# EAGLE schematic STML451RE_Buck_HSE (EAGLE 9.6.2)

## Sheet 1 of 2
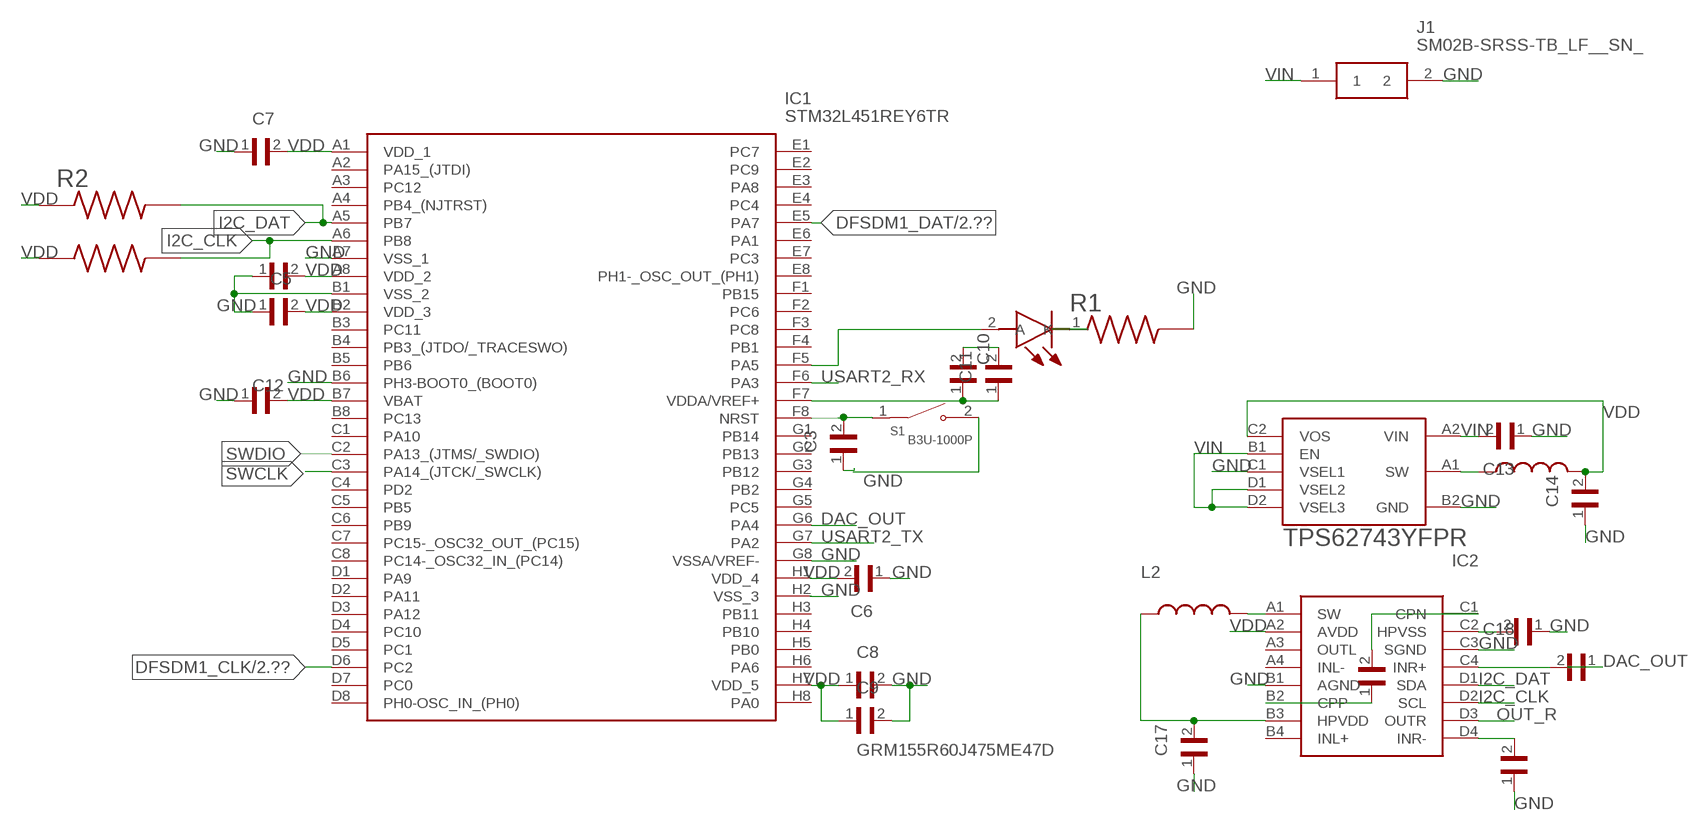
[diagram p0: schematic, sheet 1]

### Parts
C3  GRM033C80J104KE15D  [CAPC0603X33N]
C4  GRM033C80J104KE15D  [CAPC0603X33N]
C5  GRM033C80J104KE15D  [CAPC0603X33N]
C6  GRM033C80J104KE15D  [CAPC0603X33N]
C7  GRM033C80J104KE15D  [CAPC0603X33N]
C8  GRM033C80J104KE15D  [CAPC0603X33N]
C9  GRM155R60J475ME47D  [CAPC1005X60N]
C10  GRM033C80J104KE15D  [CAPC0603X33N]
C11  JMK105C6105KV-F  [CAPC1005X55N]
C12  GRM033C80J104KE15D  [CAPC0603X33N]
C13  GRM155R60J475ME47D  [CAPC1005X60N]
C14  GRM155R60J106ME15D  [CAPC1005X65N]
C17  GRM155R60J225KE95D  [CAPC1005X55N]
C18  GRM155R60J225KE95D  [CAPC1005X55N]
C19  JMK105C6105KV-F  [CAPC1005X55N]
C20  JMK105C6105KV-F  [CAPC1005X55N]
C21  JMK105C6105KV-F  [CAPC1005X55N]
IC1  STM32L451REY6TR  [BGA64C40P8X8_336X366X58]
IC2  TPA6140A2YFFT  [BGA16C40P4X4_156X156X63]
J1  SM02B-SRSS-TB_LF__SN_  [SM02B-SRSS-TB]
L1  1285AS-H-2R2M=P2  [INDC2016X100N]
L2  LQM21PN2R2MC0D  [INDC2012X55N]
LED1  VLMS1500-GS08  [VLMG1500GS08]
R1  CRCW02012K20FKED  [RESC0603X28N]
R2  ERA-2AEB122X  [RESC1005X40N]
R3  ERA-2AEB122X  [RESC1005X40N]
S1  B3U-1000P  [SW_B3U-1000P]
U1  TPS62743YFPR  [BGA8N40P2X4_87X156X50]

### Nets
DAC_OUT: C21.1 IC1.G6(PA4)
DFSDM1_CLK: IC1.D6(PC2) ; also sheet 2
DFSDM1_DAT: IC1.E5(PA7) ; also sheet 2
GND: C3.1 C4.1 C5.1 C6.1 C7.1 C8.2 C9.2 C12.1 C13.1 C14.1 C17.1 C18.1 C20.1 IC1.A7(VSS_1) IC1.B1(VSS_2) IC1.B6(PH3-BOOT0_(BOOT0)) IC1.G8(VSSA/VREF-) IC1.H2(VSS_3) IC2.B1(AGND) IC2.C3(SGND) J1.2 R1.2 U1.B2(GND) U1.C1(VSEL1) ; also sheet 2
I2C_CLK: IC1.A6(PB8) IC2.D2(SCL) R3.2
I2C_DAT: IC1.A5(PB7) IC2.D1(SDA) R2.2
N$1: IC1.F5(PA5) LED1.2(A)
N$3: IC1.F8(NRST)
N$4: C3.2 S1.1
N$5: S1.2
N$6: C10.1 C11.1 IC1.F7(VDDA/VREF+)
N$7: C10.2 C11.2
N$8: LED1.1(K) R1.1
N$9: C17.2 IC2.B3(HPVDD) L2.1
N$10: L1.1 U1.A1(SW)
N$11: IC2.A1(SW) L2.2
N$12: C18.2 IC2.C2(HPVSS)
N$13: C19.1 IC2.B2(CPP)
N$14: C19.2 IC2.C1(CPN)
N$15: C21.2 IC2.C4(INR+)
N$16: C20.2 IC2.D4(INR-)
OSC_OUT: IC1.E8(PH1-_OSC_OUT_(PH1))
OUT_R: IC2.D3(OUTR)
SWCLK: IC1.C3(PA14_(JTCK/_SWCLK))
SWDIO: IC1.C2(PA13_(JTMS/_SWDIO))
USART2_RX: IC1.F6(PA3)
USART2_TX: IC1.G7(PA2)
VDD: C4.2 C5.2 C6.2 C7.2 C8.1 C9.1 C12.2 C14.2 IC1.A1(VDD_1) IC1.A8(VDD_2) IC1.B2(VDD_3) IC1.B7(VBAT) IC1.H1(VDD_4) IC1.H7(VDD_5) IC2.A2(AVDD) L1.2 R2.1 R3.1 U1.C2(VOS) ; also sheet 2
VIN: C13.2 J1.1 U1.A2(VIN) U1.B1(EN) U1.D1(VSEL2) U1.D2(VSEL3)
Unconnected: IC1.A2(PA15_(JTDI)) IC1.A3(PC12) IC1.A4(PB4_(NJTRST)) IC1.B3(PC11) IC1.B4(PB3_(JTDO/_TRACESWO)) IC1.B5(PB6) IC1.B8(PC13) IC1.C1(PA10) IC1.C4(PD2) IC1.C5(PB5) IC1.C6(PB9) IC1.C7(PC15-_OSC32_OUT_(PC15)) IC1.C8(PC14-_OSC32_IN_(PC14)) IC1.D1(PA9) IC1.D2(PA11) IC1.D3(PA12) IC1.D4(PC10) IC1.D5(PC1) IC1.D7(PC0) IC1.D8(PH0-OSC_IN_(PH0)) IC1.E1(PC7) IC1.E2(PC9) IC1.E3(PA8) IC1.E4(PC4) IC1.E6(PA1) IC1.E7(PC3) IC1.F1(PB15) IC1.F2(PC6) IC1.F3(PC8) IC1.F4(PB1) IC1.G1(PB14) IC1.G2(PB13) IC1.G3(PB12) IC1.G4(PB2) IC1.G5(PC5) IC1.H3(PB11) IC1.H4(PB10) IC1.H5(PB0) IC1.H6(PA6) IC1.H8(PA0) IC2.A3(OUTL) IC2.A4(INL-) IC2.B4(INL+)

## Sheet 2 of 2
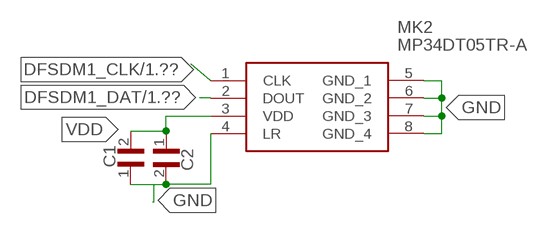
[diagram p1: schematic, sheet 2]

### Parts
C1  GRM033C80J104KE15D  [CAPC0603X33N]
C2  JMK105C6105KV-F  [CAPC1005X55N]
MK2  MP34DT05TR-A  [MP34DT05TRA]

### Nets
DFSDM1_CLK: MK2.1(CLK) ; also sheet 1
DFSDM1_DAT: MK2.2(DOUT) ; also sheet 1
GND: MK2.5(GND_1) MK2.6(GND_2) MK2.7(GND_3) MK2.8(GND_4) ; also sheet 1
N$2: C1.1 C2.2 MK2.4(LR)
VDD: C1.2 C2.1 MK2.3(VDD) ; also sheet 1

## Library data of the parts
C1 C3-C8 C10 C12 = GRM033C80J104KE15D:GRM033C80J104KE15D: .1UF 6.3V 10% 0201; DESCRIPTION: SMD Capacitor X6S(EIA) with Capacitance: 0.10uF Tol. 10%. Rated Voltage: 6.3Vdc; DIGI-KEY_PART_NUMBER: 490-10390-1-ND; DIGIKEY-PURCHASE-URL: https://snapeda.com/shop?store=DigiKey&id=1836969; MF: Murata Electronics; MP: GRM033C80J104KE15D; PACKAGE: 0603 Taiyo Yuden
C2 C11 C19-C21 = JMK105C6105KV-F:JMK105C6105KV-F: CAP CER 1UF 6.3V X6S 0402; DESCRIPTION: 1µF ±10% 6.3V Ceramic Capacitor X6S 0402 (1005 Metric); DIGI-KEY_PART_NUMBER: 587-3381-1-ND; MF: Taiyo Yuden; MP: JMK105C6105KV-F; PACKAGE: 1005 Taiyo Yuden
C9 C13 = GRM155R60J475ME47D:GRM155R60J475ME47D: Cap Ceramic 4.7uF 6.3V X5R 20% Pad SMD 0402 85°C T/R; DESCRIPTION: SMD Capacitor X5R(EIA) with Capacitance: 4.7uF Tol. 20%. Rated Voltage: 6.3Vdc; DIGI-KEY_PART_NUMBER: 490-5915-1-ND; MF: Murata; MP: GRM155R60J475ME47D; PACKAGE: 1005 Taiyo Yuden
C14 = GRM155R60J106ME15D:GRM155R60J106ME15D: Multilayer Chip Ceramic Capacitor 10µF X5R Surface Mount T/R; DESCRIPTION: SMD Capacitor X5R(EIA) with Capacitance: 10uF Tol. 20%. Rated Voltage: 6.3Vdc; DIGI-KEY_PART_NUMBER: 490-13238-1-ND; MF: Murata; MP: GRM155R60J106ME15D; PACKAGE: 1005 Murata
C17 C18 = GRM155R60J225KE95D:GRM155R60J225KE95D: CAP CER 2.2UF 6.3V X5R 0402; DESCRIPTION: 2.2µF ±10% 6.3V Ceramic Capacitor X5R 0402 (1005 Metric); DIGI-KEY_PART_NUMBER: 490-12532-1-ND; MF: Murata; MP: GRM155R60J225KE95D; PACKAGE: 1005 Taiyo Yuden
IC1 = STM32L451REY6TR:STM32L451REY6TR: ARM Microcontrollers - MCU 16/32-BITS MICROS Source: Datasheet <http://www.st.com/content/ccc/resource/technical/document/datasheet/group3/95/fa/32/09/46/cb/45/35/DM00340475/files/DM00340475.pdf/jcr:content/translations/en.DM00340475.pdf>; DESCRIPTION: ARM Microcontrollers - MCU 16/32-BITS MICROS; HEIGHT: 0.585mm; MANUFACTURER_NAME: STMicroelectronics; MANUFACTURER_PART_NUMBER: STM32L451REY6TR; MOUSER_PART_NUMBER: 511-STM32L451REY6TR; MOUSER_PRICE-STOCK: https://www.mouser.co.uk/ProductDetail/STMicroelectronics/STM32L451REY6TR?qs=Mv7BduZupUg2YTQ5MbUYvA%3D%3D
IC2 = TPA6140A2YFFT:TPA6140A2YFFT: CLASS-G DIRECTPATH STEREO HEADPHONE AMPLIFIER Source: Datasheet; ARROW_PART_NUMBER: TPA6140A2YFFT; DESCRIPTION: CLASS-G DIRECTPATH STEREO HEADPHONE AMPLIFIER; HEIGHT: mm; MANUFACTURER_NAME: Texas Instruments; MANUFACTURER_PART_NUMBER: TPA6140A2YFFT; MOUSER_PART_NUMBER: 595-TPA6140A2YFFT; MOUSER_PRICE-STOCK: https://www.mouser.com/Search/Refine.aspx?Keyword=595-TPA6140A2YFFT
J1 = SM02B-SRSS-TB_LF__SN_:SM02B-SRSS-TB_LF__SN_: CONN HEADER SH 2POS SIDE 1MM TIN Source: Datasheet <http://www.jst-mfg.com/product/pdf/eng/eSH.pdf>; ARROW_PART_NUMBER: SM02B-SRSS-TB(LF)(SN); ARROW_PRICE-STOCK: https://www.arrow.com/en/products/sm02b-srss-tb-lf-sn/jst-manufacturing; DESCRIPTION: CONN HEADER SH 2POS SIDE 1MM TIN; HEIGHT: mm; MANUFACTURER_NAME: JST (JAPAN SOLDERLESS TERMINALS); MANUFACTURER_PART_NUMBER: SM02B-SRSS-TB(LF)(SN)
L1 = 1285AS-H-2R2M_P2:1285AS-H-2R2M=P2: Ind Metal Alloy Shielded 2.2uH 20% 1MHz Powdered Iron 1.2A 0806 T/R; DESCRIPTION: Inductor with Inductance: 2.2uH Tol. +/-20%, Package: 0806 (2016); DIGI-KEY_PART_NUMBER: 490-10600-1-ND; DIGIKEY-PURCHASE-URL: https://snapeda.com/shop?store=DigiKey&id=798775; MF: Murata Electronics; MP: 1285AS-H-2R2M=P2; PACKAGE: 2016 Taiyo Yuden
L2 = LQM21PN2R2MC0D:LQM21PN2R2MC0D: INDUCTOR, 2.2UH, 20%, 0.6A, 50MHZ, 0805; DESCRIPTION: Inductor with Inductance: 2.2uH Tol. +/-20%, Package: 0805 (2012); DIGI-KEY_PART_NUMBER: 490-4994-1-ND; DIGIKEY-PURCHASE-URL: https://snapeda.com/shop?store=DigiKey&id=1501934; MF: Murata; MOUSER-PURCHASE-URL: https://snapeda.com/shop?store=Mouser&id=1501934; MP: LQM21PN2R2MC0D; PACKAGE: 2012 Murata
LED1 = VLMS1500-GS08:VLMS1500-GS08: Vishay 631 nm Red LED, 1005 (0402) SMD package Source: Datasheet <https://componentsearchengine.com/Datasheets/2/VLMS1500-GS08.pdf>; ARROW_PART_NUMBER: VLMS1500-GS08; ARROW_PRICE-STOCK: https://www.arrow.com/en/products/vlms1500-gs08/vishay; DESCRIPTION: Vishay 631 nm Red LED, 1005 (0402) SMD package; HEIGHT: mm; MANUFACTURER_NAME: Vishay; MANUFACTURER_PART_NUMBER: VLMS1500-GS08; MOUSER_PART_NUMBER: 78-VLMS1500-GS08; MOUSER_PRICE-STOCK: https://www.mouser.co.uk/ProductDetail/Vishay-Semiconductors/VLMS1500-GS08?qs=2BArZ0I3QllOybMBfd%252BobQ%3D%3D
MK2 = MP34DT05TR-A:MP34DT05TR-A: STMICROELECTRONICS - MP34DT05TR-A - MEMS MICROPHONE, 3.6V, HCLGA-4 Source: Datasheet <http://www.st.com/content/ccc/resource/technical/document/datasheet/group3/c7/90/d3/f6/b7/e7/40/c8/DM00415595/files/DM00415595.pdf/jcr:content/translations/en.DM00415595.pdf>; DESCRIPTION: STMICROELECTRONICS - MP34DT05TR-A - MEMS MICROPHONE, 3.6V, HCLGA-4; HEIGHT: 1mm; MANUFACTURER_NAME: STMicroelectronics; MANUFACTURER_PART_NUMBER: MP34DT05TR-A; MOUSER_PART_NUMBER: 511-MP34DT05TR-A; MOUSER_PRICE-STOCK: https://www.mouser.com/Search/Refine.aspx?Keyword=511-MP34DT05TR-A
R1 = CRCW02012K20FKED:CRCW02012K20FKED; DESCRIPTION: 2.2 kOhms ±1% 0.05W, 1/20W Chip Resistor 0201 (0603 Metric) Thick Film; DIGI-KEY_PART_NUMBER: 541-2.20KAABCT-ND; DIGIKEY-PURCHASE-URL: https://snapeda.com/shop?store=DigiKey&id=4092052; MF: Vishay; MP: CRCW02012K20FKED; PACKAGE: 0603 Vishay
R2 R3 = ERA-2AEB122X:ERA-2AEB122X; DESCRIPTION: Res Thin Film 0402 1.2K Ohm 0.1% 0.063W(1/16W) ±25ppm/°C Pad SMD Automotive T/R; DIGI-KEY_PART_NUMBER: P1.2KDCCT-ND; DIGIKEY-PURCHASE-URL: https://snapeda.com/shop?store=DigiKey&id=3718075; MF: Panasonic; MOUSER-PURCHASE-URL: https://snapeda.com/shop?store=Mouser&id=3718075; MP: ERA-2AEB122X; PACKAGE: 1005 Panasonic Electronic Components
S1 = B3U-1000P:B3U-1000P: Switch Tactile N.O. SPST Round Button Gull Wing 0.05A 12VDC 1.5N SMD Embossed T/R; DESCRIPTION: Tactile Switch SPST-NO Top Actuated Surface Mount; DIGI-KEY_PART_NUMBER: SW1020CT-ND; DIGIKEY-PURCHASE-URL: https://snapeda.com/shop?store=DigiKey&id=104326; MF: Omron; MP: B3U-1000P; PACKAGE: None
U1 = TPS62743YFPR:TPS62743YFPR: Conv DC-DC Single Step Down 2.15V to 5.5V 8-Pin DSBGA T/R; DESCRIPTION: Buck Switching Regulator IC Positive Programmable 1.2V 1 Output 300mA 8-XFBGA, DSBGA; DIGI-KEY_PART_NUMBER: 296-42392-1-ND; DIGIKEY-PURCHASE-URL: https://snapeda.com/shop?store=DigiKey&id=485129; MF: Texas Instruments; MP: TPS62743YFPR; PACKAGE: DSBGA-8 Texas Instruments